# EAGLE design untitled (EAGLE 9.6.2)
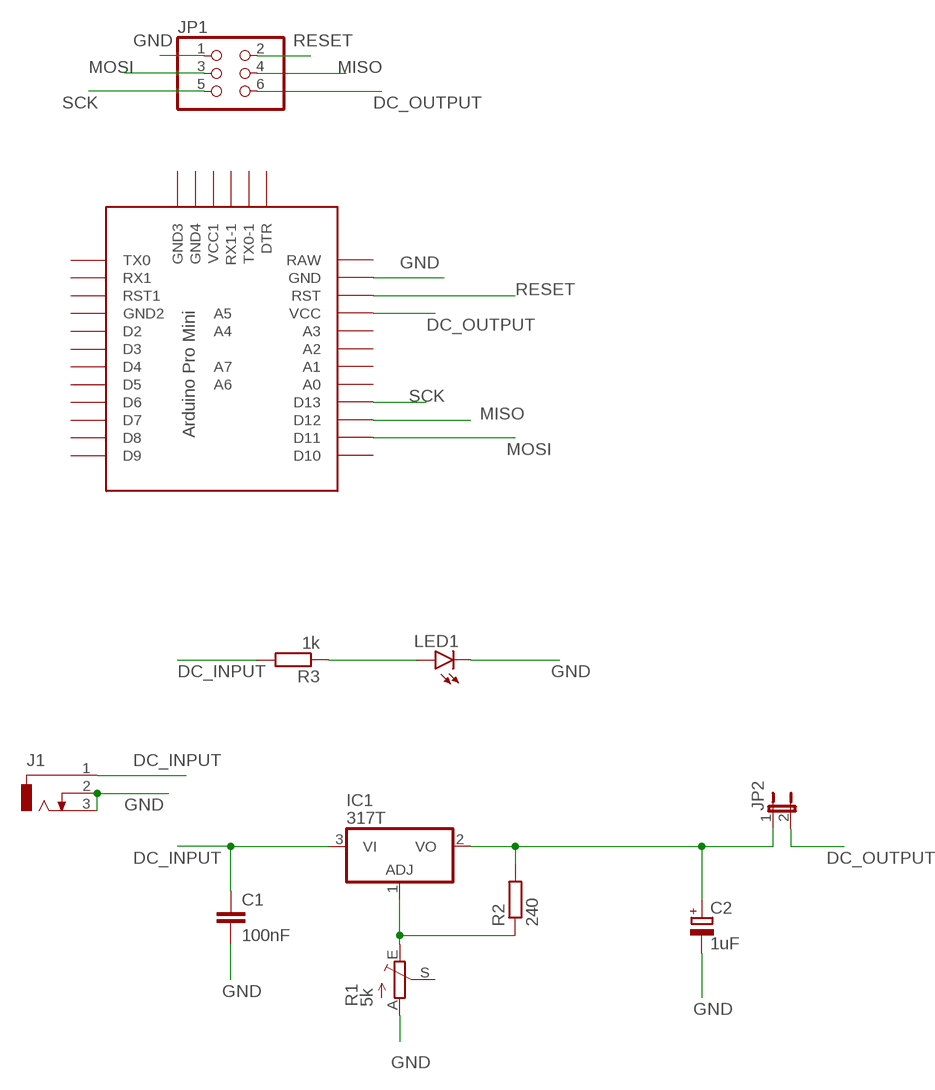
[diagram p0: schematic, sheet 1]

## Parts
C1  100nF  C-EU025-025X050  [C025-025X050]
C2  1uF  CPOL-EUE2.5-5  [E2,5-5]
IC1  317T  [TO220H]
J1  DCJ0303  [DCJ0303]
JP1  PINHD-2X3  [2X03]
JP2  JP1E  [JP1]
LED1  LED5MM  [LED5MM]
R1  5k  TRIM_1234-S64YW  [S64YW]
R2  240  R-EU_0204/5  [0204/5]
R3  1k  R-EU_0204/5  [0204/5]
U$1  PRO-MINI-2  [PRO-MINI-2]

## Nets
DC_INPUT: C1.1 IC1.3(VI) J1.1 R3.2
DC_OUTPUT: JP1.6 JP2.2 U$1.VCC
GND: C1.2 C2.- J1.2 J1.3 JP1.1 LED1.K(C) R1.A U$1.GND
MISO: JP1.4 U$1.D12
MOSI: JP1.3 U$1.D11
N$1: IC1.1(ADJ) R1.E R2.1
N$3: C2.+ IC1.2(VO) JP2.1 R2.2
N$7: LED1.A R3.1
RESET: JP1.2 U$1.RST
SCK: JP1.5 U$1.D13
Unconnected: R1.S R1.S@1(S) U$1.A0 U$1.A1 U$1.A2 U$1.A3 U$1.A4 U$1.A5 U$1.A6 U$1.A7 U$1.D2 U$1.D3 U$1.D4 U$1.D5 U$1.D6 U$1.D7 U$1.D8 U$1.D9 U$1.D10 U$1.DTR U$1.GND1(GND2) U$1.GND2(GND3) U$1.GND3(GND4) U$1.RAW U$1.RST1 U$1.RX1 U$1.RX1-1 U$1.TX0 U$1.TX0-1 U$1.VCC1

## Library data of the parts
C1 = rcl:C-EU: CAPACITOR, European symbol; SPICEPREFIX: C
C2 = rcl:CPOL-EU: POLARIZED CAPACITOR, European symbol; SPICEPREFIX: C
IC1 = linear:*317: Positive VOLTAGE REGULATOR
J1 = con-jack:DCJ0303: DC POWER JACK Source: DCJ0303.pdf; OC_FARNELL: unknown; OC_NEWARK: unknown
JP1 = pinhead:PINHD-2X3: PIN HEADER
JP2 = jumper:JP1E: JUMPER
LED1 = led:LED: LED OSRAM: - CHIPLED LG R971, LG N971, LY N971, LG Q971, LY Q971, LO R971, LY R971 LH N974, LH R974 LS Q976, LO Q976, LY Q976 LO Q996 - Hyper CHIPLED LW Q18S LB Q993, LB Q99A, LB R99A - SideLED LS A670, LO A670, LY A670, LG A670, LP A670 LB A673, LV A673, LT A673, LW A673 LH A674 LY A675 LS A676, LA A676, LO A676, LY A676, LW A676 LS A679, LY A679, LG A679 - Hyper Micro SIDELED® LS Y876, LA Y876, LO Y876, LY Y876 LT Y87S - SmartLED LW L88C, LW L88S LB L89C, LB L89S, LG L890 LS L89K, LO L89K, LY L89K LS L896, LA L896, LO L896, LY L896 - TOPLED LS T670, LO T670, LY T670, LG T670, LP T670 LSG T670, LSP T670, LSY T670, LOP T670, LYG T670 LG T671, LOG T671, LSG T671 LB T673, LV T673, LT T673, LW T673 LH T674 LS T676, LA T676, LO T676, LY T676, LB T676, LH T676, LSB T676, LW T676 LB T67C, LV T67C, LT T67C, LS T67K, LO T67K, LY T67K, LW E67C LS E67B, LA E67B, LO E67B, LY E67B, LB E67C, LV E67C, LT E67C LW T67C LS T679, LY T679, LG T679 LS T770, LO T770, LY T770, LG T770, LP T770 LB T773, LV T773, LT T773, LW T773 LH T774 LS E675, LA E675, LY E675, LS T675 LS T776, LA T776, LO T776, LY T776, LB T776 LHGB T686 LT T68C, LB T68C - Hyper Mini TOPLED® LB M676 - Mini TOPLED Santana® LG M470 LS M47K, LO M47K, LY M47K Source: http://www.osram.convergy.de LUXEON: - LUMILED® LXK2-PW12-R00, LXK2-PW12-S00, LXK2-PW14-U00, LXK2-PW14-V00 LXK2-PM12-R00, LXK2-PM12-S00, LXK2-PM14-U00 LXK2-PE12-Q00, LXK2-PE12-R00, LXK2-PE12-S00, LXK2-PE14-T00, LXK2-PE14-U00 LXK2-PB12-K00, LXK2-PB12-L00, LXK2-PB12-M00, LXK2-PB14-N00, LXK2-PB14-P00, LXK2-PB14-Q00 LXK2-PR12-L00, LXK2-PR12-M00, LXK2-PR14-Q00, LXK2-PR14-R00 LXK2-PD12-Q00, LXK2-PD12-R00, LXK2-PD12-S00 LXK2-PH12-R00, LXK2-PH12-S00 LXK2-PL12-P00, LXK2-PL12-Q00, LXK2-PL12-R00 Source: www.luxeon.com KINGBRIGHT: KA-3528ASYC Source: www.kingbright.com
R1 = pot:TRIM_1234-: POTENTIOMETER
R2 R3 = rcl:R-EU_: RESISTOR, European symbol; SPICEPREFIX: R
U$1 = Arduino-clone:PRO-MINI-2: Arduino Pro Mini Layout 2 Sparkfun.com

## Board
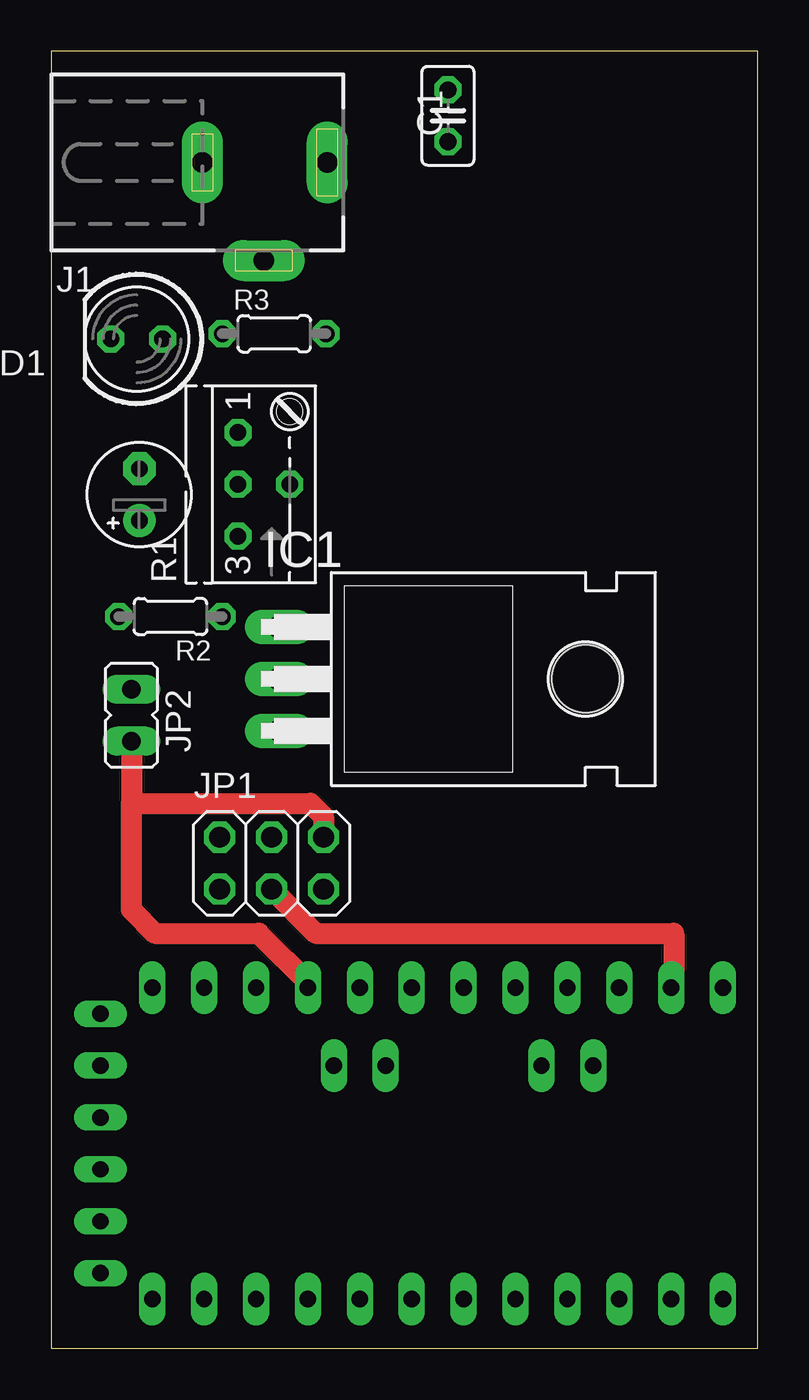
[diagram p1: board, top side]
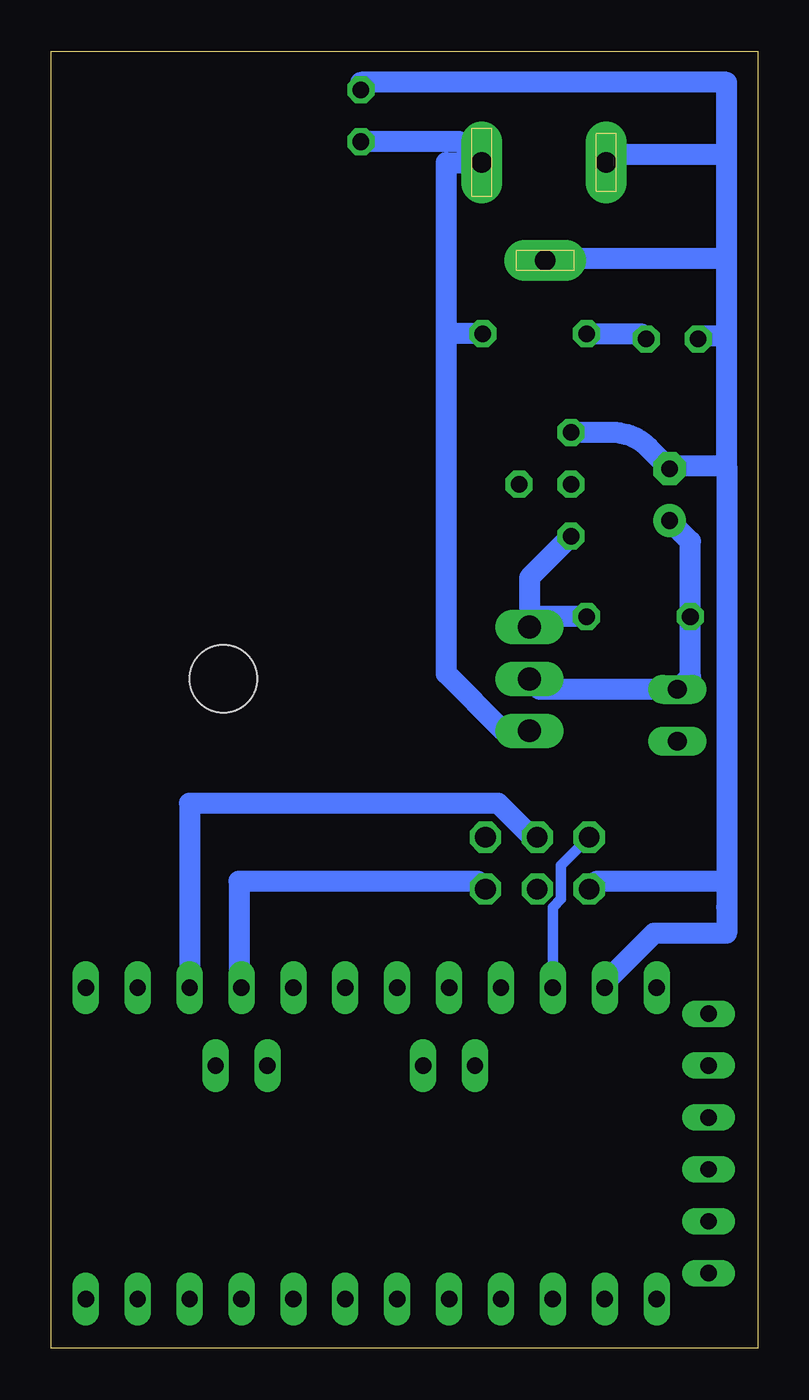
[diagram p2: board, bottom side, seen from below]

Size 34.59 x 63.49 mm. Coordinates in mm from the lower left corner, seen from the top.
Outline: 0,0 34.59,0 34.59,63.49 0,63.49 0,0
Copper layers (1*16): Top 0.035mm / dielectric 1.5mm / Bottom 0.035mm
Design rules "default": minimum track width 6mil, minimum drill 0.35mm, track to track 6mil, track to pad 6mil, pad to pad 6mil, via to via 6mil, smd to smd 6mil, copper to edge 40mil, drill to drill 6mil, minimum pad ring 10mil, minimum via ring 8mil, stop-mask expansion 4mil, vias tented up to drill 0mil, thermal gap 10mil

### Footprints (pad centres in the part's own frame; a part is rotated, then mirrored left to right if it is on the bottom)
C025-025X050 = drill 0.813 octagon: 1 -1.27,0; 2 1.27,0
E2,5-5 = drill 0.813 pad 1.6: + -1.27,0 | drill 0.813 pad 1.6 octagon: - 1.27,0
TO220H = drill 1.118 long: 1 -2.54,-10.16; 2 0,-10.16; 3 2.54,-10.16 | hole 3.302: 0,4.826
DCJ0303 = drill 1 pad 2 long: 1 0,3.1; 2 4.8,0; 3 0,-3
2X03 = drill 1.016 octagon: 1 -2.54,-1.27; 2 -2.54,1.27; 3 0,-1.27; 4 0,1.27; 5 2.54,-1.27; 6 2.54,1.27
JP1 = drill 0.914 long: 1 0,-1.27; 2 0,1.27
LED5MM = drill 0.813 octagon: A -1.27,0; K 1.27,0
S64YW = drill 0.813 octagon: A 2.54,1.27; E -2.54,1.27; S 0,-1.27; S@1 0,1.27
0204/5 = drill 0.813 octagon: 1 -2.54,0; 2 2.54,0
PRO-MINI-2 = drill 0.8 long: A0 6.35,2.54; A1 6.35,0; A2 6.35,-2.54; A3 6.35,-5.08; A4 2.54,1.27; A5 2.54,3.81; A6 2.54,-8.89; A7 2.54,-6.35; D2 -8.89,2.54; D3 -8.89,0; D4 -8.89,-2.54; D5 -8.89,-5.08; D6 -8.89,-7.62; D7 -8.89,-10.16; D8 -8.89,-12.7; D9 -8.89,-15.24; D10 6.35,-15.24; D11 6.35,-12.7; D12 6.35,-10.16; D13 6.35,-7.62; DTR 5.08,15.24; GND 6.35,10.16; GND1 -8.89,5.08; GND2 -7.62,15.24; GND3 -5.08,15.24; RAW 6.35,12.7; RST 6.35,7.62; RST1 -8.89,7.62; RX1 -8.89,10.16; RX1-1 0,15.24; TX0 -8.89,12.7; TX0-1 2.54,15.24; VCC 6.35,5.08; VCC1 -2.54,15.24

### Placement (x,y rotation side)
C1  19.43,60.32 90 top
C2  4.32,41.78 90 top
IC1  21.34,32.77 270 top
J1  10.41,58.04 270 top
JP1  10.79,23.75 0 top
JP2  3.94,30.99 180 top
LED1  4.19,49.4 180 top
R1  10.41,42.29 90 top
R2  5.84,35.81 180 top
R3  10.92,49.66 0 top
U$1  17.65,11.3 90 top

### Tracks (layer width: path | path; a pad name or v marks a point on that pad's centre or on a via)
DC_INPUT
  Bottom 1.016: C1.1 14.53,59.05 J1.1 15.24,58.04 15.24,49.53 15.11,49.66 | IC1.3 12.45,30.23 15.24,33.02 15.24,49.66 R3.2
DC_OUTPUT
  Top 1.016: JP2.2 3.94,26.67 | 3.94,26.67 3.94,21.46 5.08,20.32 10.16,20.32 12.7,17.78 U$1.VCC | 3.94,26.67 12.7,26.67 13.34,26.04 JP1.6
GND
  Bottom 1.016: R1.A 7.15,44.83 arc45 5.35,44.09 C2.- 4.32,43.18 1.52,43.18 | C1.2 19.43,61.97 1.52,61.97 1.52,58.42 | 1.52,43.18 1.52,22.86 | 1.52,22.86 1.52,21.59 1.52,20.32 5.08,20.32 7.49,17.91 U$1.GND | 1.52,43.18 1.52,49.53 | 1.52,49.53 1.52,53.34 | 1.52,53.34 1.52,58.42 | 1.52,58.42 7.41,58.42 J1.3 | 1.52,53.34 10.41,53.34 J1.2 | 1.52,49.53 2.92,49.53 LED1.K | 1.52,22.86 7.87,22.86 JP1.1
MISO
  Bottom 1.016: JP1.4 11.05,25.02 12.7,26.67 27.81,26.67 U$1.D12
MOSI
  Top 1.016: JP1.3 12.95,20.32 30.48,20.32 30.48,17.78 U$1.D11
N$1
  Bottom 1.016: R1.E 11.18,37.72 IC1.1 10.67,35.81 R2.1
N$3
  Bottom 1.016: C2.+ 3.3,39.5 R2.2 3.3,32.89 JP2.1 10.67,32.26 IC1.2
N$7
  Bottom 1.016: R3.1 5.71,49.66 LED1.A
RESET
  Bottom 0.508: U$1.RST 10.03,21.59 9.63,22 9.63,23.65 JP1.2
SCK
  Bottom 1.016: JP1.5 13.72,22.86 25.4,22.86 25.4,17.78 U$1.D13